# Altium schematic sheet BasicPeripherals.SchDoc
size A3
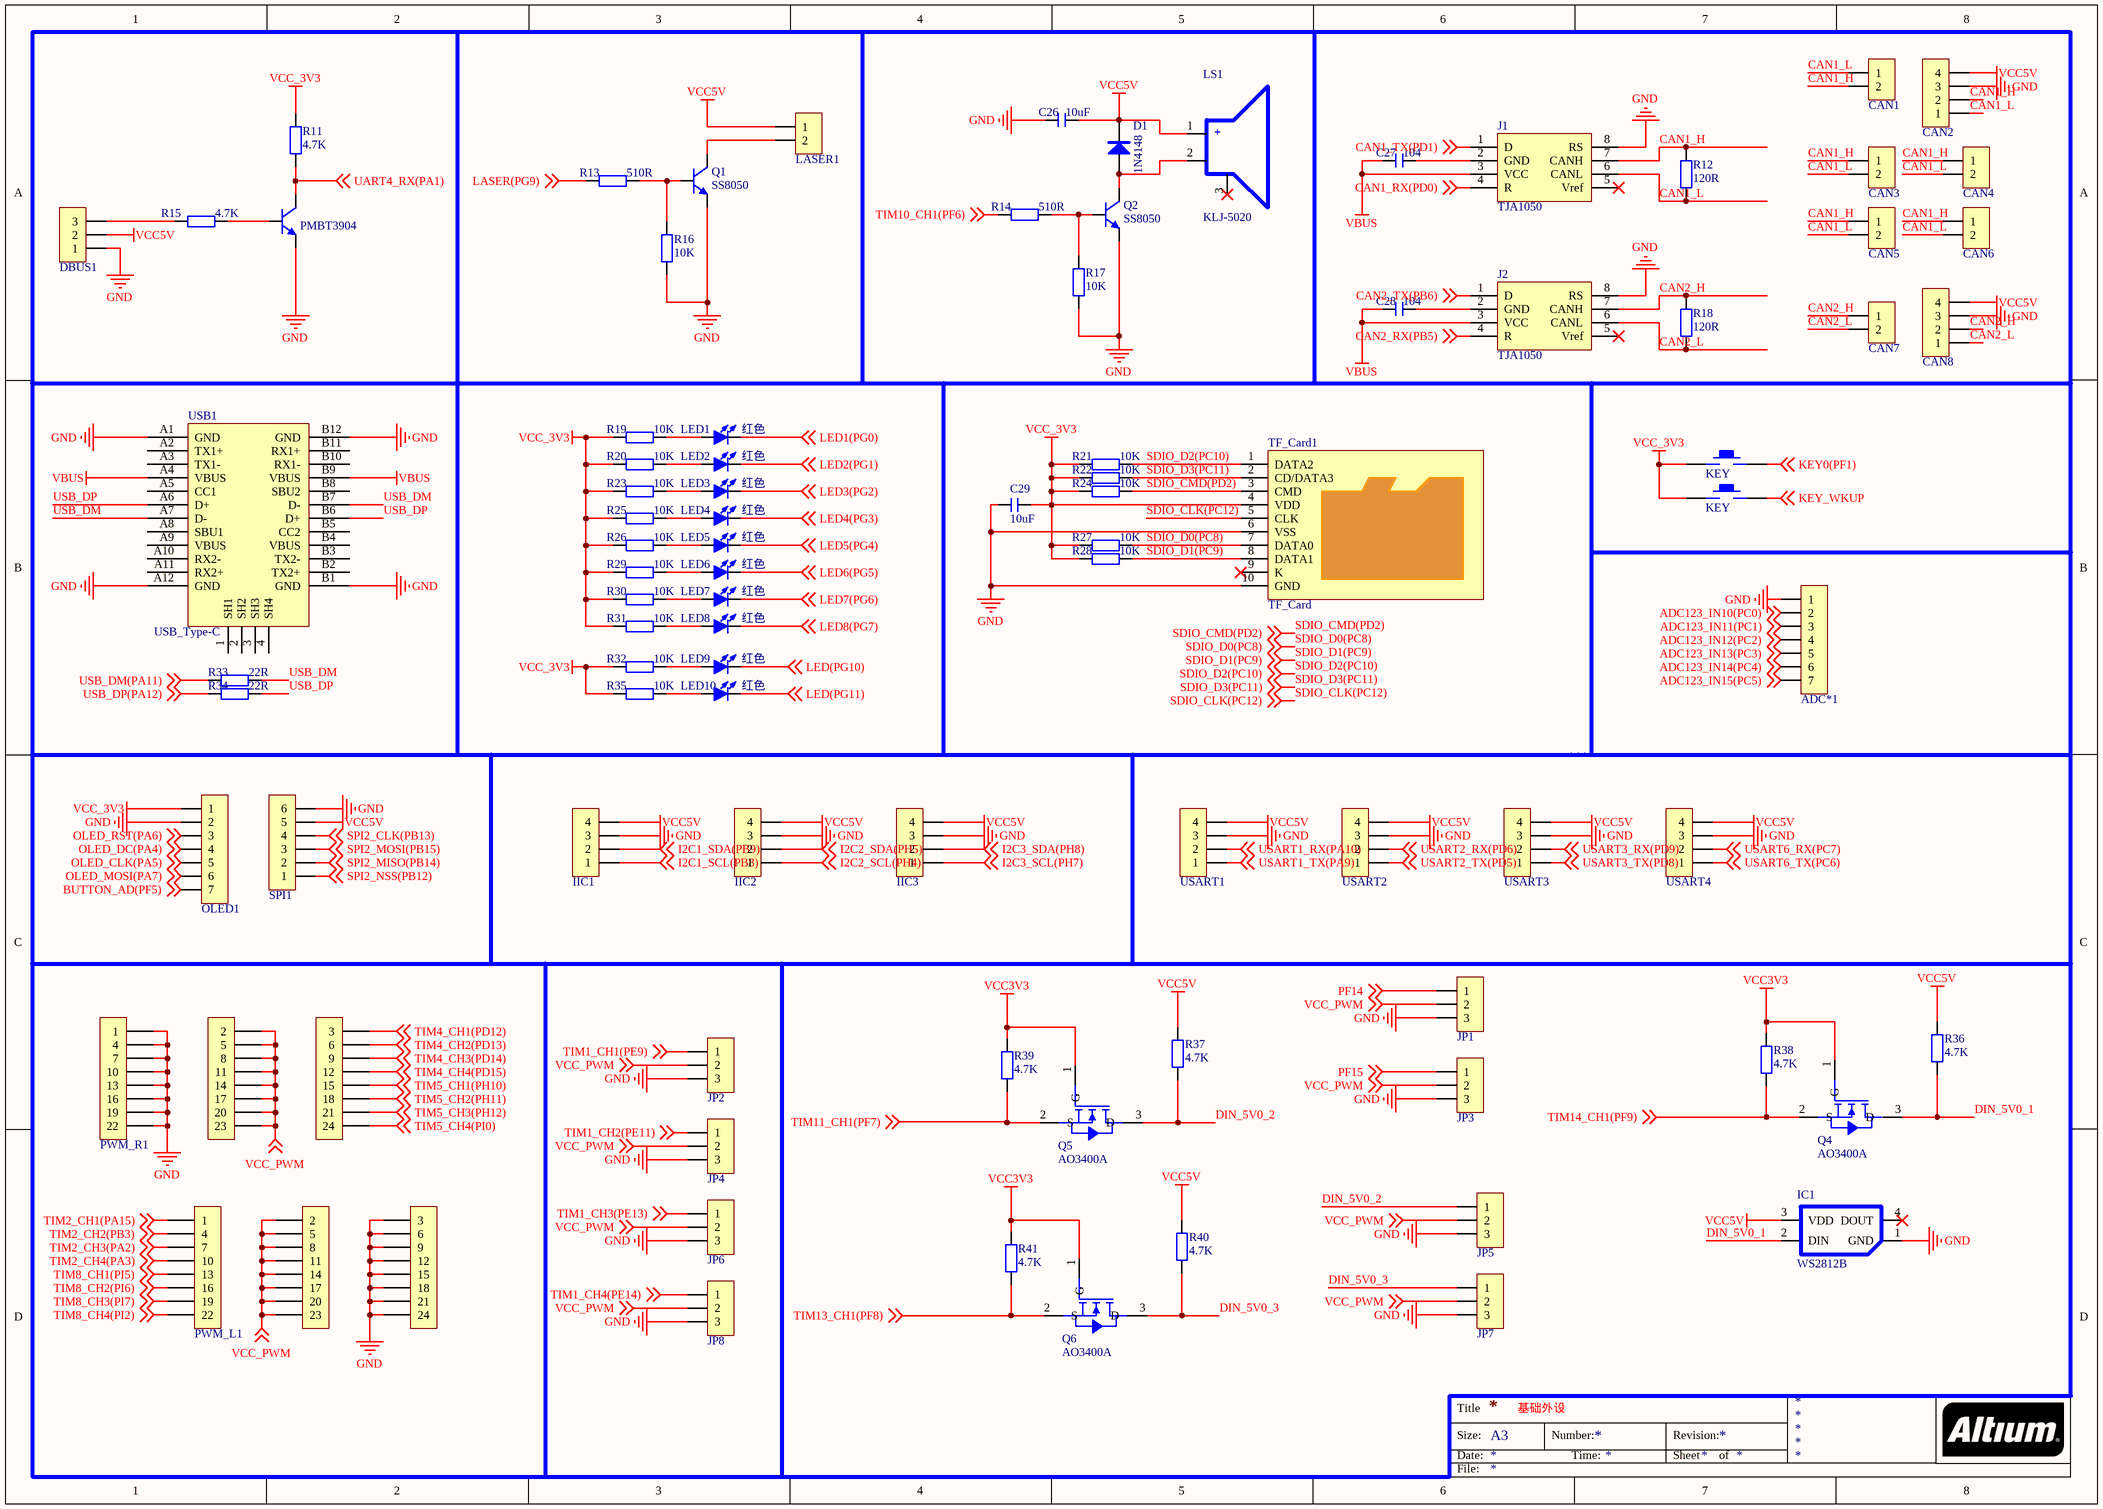
[diagram p0: BasicPeripherals.SchDoc]

## Parts
ADC*1  HDR-1X7  [MX 1.25-WS-7P]  (value not drawn)
C26  10uF  [C 0402_M]
C27  104  [C 0603_L]
C28  104  [C 0603_L]
C29  10uF  [C 0402_M]
CAN1  HDR-1X2  [MX 1.25-WS-2P]  (value not drawn)
CAN2  HDR-1X4  [MX 1.25-WS-4P]  (value not drawn)
CAN3  HDR-1X2  [MX 1.25-LS-2P]  (value not drawn)
CAN4  HDR-1X2  [MX 1.25-LS-2P]  (value not drawn)
CAN5  HDR-1X2  [MX 1.25-LS-2P]  (value not drawn)
CAN6  HDR-1X2  [MX 1.25-LS-2P]  (value not drawn)
CAN7  HDR-1X2  [MX 1.25-LS-2P]  (value not drawn)
CAN8  HDR-1X4  [MX 1.25-LS-4P]  (value not drawn)
D1  1N4148  [SOD-323]
DBUS1  HDR-1X3  [HDR2.54-WS-3P]  (value not drawn)
IC1  WS2812B  [LED 3528-4Pin]
IIC1  HDR-1X4  [MX 1.25-LS-4P]  (value not drawn)
IIC2  HDR-1X4  [MX 1.25-LS-4P]  (value not drawn)
IIC3  HDR-1X4  [MX 1.25-LS-4P]  (value not drawn)
J1  TJA1050  [SOIC-8_150mil]
J2  TJA1050  [SOIC-8_150mil]
JP1  HDR-1X3  [HDR2.54-LI-3P]  (value not drawn)
JP2  HDR-1X3  [HDR2.54-LI-3P]  (value not drawn)
JP3  HDR-1X3  [HDR2.54-LI-3P]  (value not drawn)
JP4  HDR-1X3  [HDR2.54-LI-3P]  (value not drawn)
JP5  HDR-1X3  [HDR2.54-LI-3P]  (value not drawn)
JP6  HDR-1X3  [HDR2.54-LI-3P]  (value not drawn)
JP7  HDR-1X3  [HDR2.54-LI-3P]  (value not drawn)
JP8  HDR-1X3  [HDR2.54-LI-3P]  (value not drawn)
LASER1  HDR-1X2  [MX 1.25-LS-2P]  (value not drawn)
LED1  红色  [LED 0805G]
LED2  红色  [LED 0805G]
LED3  红色  [LED 0805G]
LED4  红色  [LED 0805G]
LED5  红色  [LED 0805G]
LED6  红色  [LED 0805G]
LED7  红色  [LED 0805G]
LED8  红色  [LED 0805G]
LED9  红色  [LED 0805R]
LED10  红色  [LED 0805R]
LS1  KLJ-5020  [BUZ-SMD_4P-L5.0-W5.0-P3.80-TL]
OLED1  HDR-1X7  [MX 1.25-WS-7P]  (value not drawn)
PWM_L1  HDR3*8-left  [PIN-3*8-2.54 - duplicate]  (value not drawn)
PWM_R1  HDR3*8-right  [PIN-3*8-2.54 - duplicate]  (value not drawn)
Q1  SS8050  [SOT23-3L]
Q2  SS8050  [SOT23-3L]
Q3  PMBT3904  [SOT-23-3]
Q4  AO3400A  [SOT-23-3_L2.9-W1.3-P1.90-LS2.4-BR]
Q5  AO3400A  [SOT-23-3_L2.9-W1.3-P1.90-LS2.4-BR]
Q6  AO3400A  [SOT-23-3_L2.9-W1.3-P1.90-LS2.4-BR]
R11  4.7K  [R 0402_M]
R12  120R  [R 0402_M]
R13  510R  [R 0402_M]
R14  510R  [R 0402_M]
R15  4.7K  [R 0402_M]
R16  10K  [R 0402_M]
R17  10K  [R 0402_M]
R18  120R  [R 0402_M]
R19  10K  [R 0402_M]
R20  10K  [R 0402_M]
R21  10K  [R 0402_M]
R22  10K  [R 0402_M]
R23  10K  [R 0402_M]
R24  10K  [R 0402_M]
R25  10K  [R 0402_M]
R26  10K  [R 0402_M]
R27  10K  [R 0402_M]
R28  10K  [R 0402_M]
R29  10K  [R 0402_M]
R30  10K  [R 0402_M]
R31  10K  [R 0402_M]
R32  10K  [R 0402_M]
R33  22R  [R 0402_M]
R34  22R  [R 0402_M]
R35  10K  [R 0402_M]
R36  4.7K  [R 0402_M]
R37  4.7K  [R 0402_M]
R38  4.7K  [R 0402_M]
R39  4.7K  [R 0402_M]
R40  4.7K  [R 0402_M]
R41  4.7K  [R 0402_M]
RST2  KEY  [SMD-3.2*4.2]
RST3  KEY  [SMD-3.2*4.2]
SPI1  HDR-1X6  [MX 1.25-LS-6P]  (value not drawn)
TF_Card1  TF_Card  [Micro SD]
USART1  HDR-1X4  [MX 1.25-LS-4P]  (value not drawn)
USART2  HDR-1X4  [MX 1.25-LS-4P]  (value not drawn)
USART3  HDR-1X4  [MX 1.25-LS-4P]  (value not drawn)
USART4  HDR-1X4  [MX 1.25-LS-4P]  (value not drawn)
USB1  USB_Type-C  [Type-C-TOP]

## Nets
GND: ADC*1.1 C26.2 C29.1 CAN2.3 CAN8.3 DBUS1.1 IC1.1(GND) IIC1.3 IIC2.3 IIC3.3 J1.8(RS) J2.8(RS) JP1.3 JP2.3 JP3.3 JP4.3 JP5.3 JP6.3 JP7.3 JP8.3 OLED1.2 PWM_L1.3 PWM_L1.6 PWM_L1.9 PWM_L1.12 PWM_L1.15 PWM_L1.18 PWM_L1.21 PWM_L1.24 PWM_R1.1 PWM_R1.4 PWM_R1.7 PWM_R1.10 PWM_R1.13 PWM_R1.16 PWM_R1.19 PWM_R1.22 Q1.2(E) Q2.2(E) Q3.2(E) R16.1 R17.1 SPI1.6 TF_Card1.6(VSS) TF_Card1.10(GND) USART1.3 USART2.3 USART3.3 USART4.3 USB1.A1(GND) USB1.A12(GND) USB1.B1(GND) USB1.B12(GND)
VBUS: C27.2 C28.2 J1.3(VCC) J2.3(VCC) USB1.A4(VBUS) USB1.B9(VBUS)
VCC3V3: Q4.1(G) Q5.1(G) Q6.1(G) R38.1 R39.1 R41.1
VCC5V: C26.1 CAN2.4 CAN8.4 D1.2(K) DBUS1.2 IC1.3(VDD) IIC1.4 IIC2.4 IIC3.4 LASER1.1 LS1.1 R36.1 R37.1 R40.1 SPI1.5 USART1.4 USART2.4 USART3.4 USART4.4
VCC_3V3: C29.2 OLED1.1 R11.2 R19.1 R20.1 R21.1 R22.1 R23.1 R24.1 R25.1 R26.1 R27.1 R28.1 R29.1 R30.1 R31.1 R32.1 R35.1 RST2.1 RST3.1 TF_Card1.4(VDD)
ADC123_IN10(PC0): ADC*1.2 ; off-sheet ADC123_IN10(PC0)
ADC123_IN11(PC1): ADC*1.3 ; off-sheet ADC123_IN11(PC1)
ADC123_IN12(PC2): ADC*1.4 ; off-sheet ADC123_IN12(PC2)
ADC123_IN13(PC3): ADC*1.5 ; off-sheet ADC123_IN13(PC3)
ADC123_IN14(PC4): ADC*1.6 ; off-sheet ADC123_IN14(PC4)
ADC123_IN15(PC5): ADC*1.7 ; off-sheet ADC123_IN15(PC5)
BUTTON_AD(PF5): OLED1.7 ; off-sheet BUTTON_AD(PF5)
CAN1_H: CAN1.2 CAN2.2 CAN3.1 CAN4.1 CAN5.1 CAN6.1 J1.7(CANH) R12.2
CAN1_L: CAN1.1 CAN2.1 CAN3.2 CAN4.2 CAN5.2 CAN6.2 J1.6(CANL) R12.1
CAN1_RX(PD0): J1.4(R) ; off-sheet CAN1_RX(PD0)
CAN1_TX(PD1): J1.1(D) ; off-sheet CAN1_TX(PD1)
CAN2_H: CAN7.1 CAN8.2 J2.7(CANH) R18.2
CAN2_L: CAN7.2 CAN8.1 J2.6(CANL) R18.1
CAN2_RX(PB5): J2.4(R) ; off-sheet CAN2_RX(PB5)
CAN2_TX(PB6): J2.1(D) ; off-sheet CAN2_TX(PB6)
DIN_5V0_1: IC1.2(DIN) Q4.3(D) R36.2
DIN_5V0_2: JP5.1 Q5.3(D) R37.2
DIN_5V0_3: JP7.1 Q6.3(D) R40.2
I2C1_SCL(PB8): IIC1.1 ; off-sheet I2C1_SCL(PB8)
I2C1_SDA(PB9): IIC1.2 ; off-sheet I2C1_SDA(PB9)
I2C2_SCL(PH4): IIC2.1 ; off-sheet I2C2_SCL(PH4)
I2C2_SDA(PH5): IIC2.2 ; off-sheet I2C2_SDA(PH5)
I2C3_SCL(PH7): IIC3.1 ; off-sheet I2C3_SCL(PH7)
I2C3_SDA(PH8): IIC3.2 ; off-sheet I2C3_SDA(PH8)
KEY0(PF1): RST2.2 ; off-sheet KEY0(PF1)
KEY_WKUP: RST3.2 ; off-sheet KEY_WKUP
LASER(PG9): R13.1 ; off-sheet LASER(PG9)
LED1(PG0): LED1.2(K) ; off-sheet LED1(PG0)
LED2(PG1): LED2.2(K) ; off-sheet LED2(PG1)
LED3(PG2): LED3.2(K) ; off-sheet LED3(PG2)
LED4(PG3): LED4.2(K) ; off-sheet LED4(PG3)
LED5(PG4): LED5.2(K) ; off-sheet LED5(PG4)
LED6(PG5): LED6.2(K) ; off-sheet LED6(PG5)
LED7(PG6): LED7.2(K) ; off-sheet LED7(PG6)
LED8(PG7): LED8.2(K) ; off-sheet LED8(PG7)
LED(PG10): LED9.2(K) ; off-sheet LED(PG10)
LED(PG11): LED10.2(K) ; off-sheet LED(PG11)
OLED_CLK(PA5): OLED1.5 ; off-sheet OLED_CLK(PA5)
OLED_DC(PA4): OLED1.4 ; off-sheet OLED_DC(PA4)
OLED_MOSI(PA7): OLED1.6 ; off-sheet OLED_MOSI(PA7)
OLED_RST(PA6): OLED1.3 ; off-sheet OLED_RST(PA6)
PF14: JP1.1 ; off-sheet PF14
PF15: JP3.1 ; off-sheet PF15
SDIO_CLK(PC12): TF_Card1.5(CLK) ; off-sheet SDIO_CLK(PC12)
SDIO_CMD(PD2): R24.2 TF_Card1.3(CMD) ; off-sheet SDIO_CMD(PD2)
SDIO_D0(PC8): R27.2 TF_Card1.7(DATA0) ; off-sheet SDIO_D0(PC8)
SDIO_D1(PC9): R28.2 TF_Card1.8(DATA1) ; off-sheet SDIO_D1(PC9)
SDIO_D2(PC10): R21.2 TF_Card1.1(DATA2) ; off-sheet SDIO_D2(PC10)
SDIO_D3(PC11): R22.2 TF_Card1.2(CD/DATA3) ; off-sheet SDIO_D3(PC11)
SPI2_CLK(PB13): SPI1.4 ; off-sheet SPI2_CLK(PB13)
SPI2_MISO(PB14): SPI1.2 ; off-sheet SPI2_MISO(PB14)
SPI2_MOSI(PB15): SPI1.3 ; off-sheet SPI2_MOSI(PB15)
SPI2_NSS(PB12): SPI1.1 ; off-sheet SPI2_NSS(PB12)
TIM1_CH1(PE9): JP2.1 ; off-sheet TIM1_CH1(PE9)
TIM1_CH2(PE11): JP4.1 ; off-sheet TIM1_CH2(PE11)
TIM1_CH3(PE13): JP6.1 ; off-sheet TIM1_CH3(PE13)
TIM1_CH4(PE14): JP8.1 ; off-sheet TIM1_CH4(PE14)
TIM2_CH1(PA15): PWM_L1.1 ; off-sheet TIM2_CH1(PA15)
TIM2_CH2(PB3): PWM_L1.4 ; off-sheet TIM2_CH2(PB3)
TIM2_CH3(PA2): PWM_L1.7 ; off-sheet TIM2_CH3(PA2)
TIM2_CH4(PA3): PWM_L1.10 ; off-sheet TIM2_CH4(PA3)
TIM4_CH1(PD12): PWM_R1.3 ; off-sheet TIM4_CH1(PD12)
TIM4_CH2(PD13): PWM_R1.6 ; off-sheet TIM4_CH2(PD13)
TIM4_CH3(PD14): PWM_R1.9 ; off-sheet TIM4_CH3(PD14)
TIM4_CH4(PD15): PWM_R1.12 ; off-sheet TIM4_CH4(PD15)
TIM5_CH1(PH10): PWM_R1.15 ; off-sheet TIM5_CH1(PH10)
TIM5_CH2(PH11): PWM_R1.18 ; off-sheet TIM5_CH2(PH11)
TIM5_CH3(PH12): PWM_R1.21 ; off-sheet TIM5_CH3(PH12)
TIM5_CH4(PI0): PWM_R1.24 ; off-sheet TIM5_CH4(PI0)
TIM8_CH1(PI5): PWM_L1.13 ; off-sheet TIM8_CH1(PI5)
TIM8_CH2(PI6): PWM_L1.16 ; off-sheet TIM8_CH2(PI6)
TIM8_CH3(PI7): PWM_L1.19 ; off-sheet TIM8_CH3(PI7)
TIM8_CH4(PI2): PWM_L1.22 ; off-sheet TIM8_CH4(PI2)
TIM10_CH1(PF6): R14.1 ; off-sheet TIM10_CH1(PF6)
TIM11_CH1(PF7): Q5.2(S) R39.2 ; off-sheet TIM11_CH1(PF7)
TIM13_CH1(PF8): Q6.2(S) R41.2 ; off-sheet TIM13_CH1(PF8)
TIM14_CH1(PF9): Q4.2(S) R38.2 ; off-sheet TIM14_CH1(PF9)
UART4_RX(PA1): Q3.3(C) R11.1 ; off-sheet UART4_RX(PA1)
USART1_RX(PA10): USART1.2 ; off-sheet USART1_RX(PA10)
USART1_TX(PA9): USART1.1 ; off-sheet USART1_TX(PA9)
USART2_RX(PD6): USART2.2 ; off-sheet USART2_RX(PD6)
USART2_TX(PD5): USART2.1 ; off-sheet USART2_TX(PD5)
USART3_RX(PD9): USART3.2 ; off-sheet USART3_RX(PD9)
USART3_TX(PD8): USART3.1 ; off-sheet USART3_TX(PD8)
USART6_RX(PC7): USART4.2 ; off-sheet USART6_RX(PC7)
USART6_TX(PC6): USART4.1 ; off-sheet USART6_TX(PC6)
USB_DM: R33.2 USB1.A7(D-) USB1.B7(D-)
USB_DM(PA11): R33.1 ; off-sheet USB_DM(PA11)
USB_DP: R34.2 USB1.A6(D+) USB1.B6(D+)
USB_DP(PA12): R34.1 ; off-sheet USB_DP(PA12)
VCC_PWM: JP1.2 JP2.2 JP3.2 JP4.2 JP5.2 JP6.2 JP7.2 JP8.2 PWM_L1.2 PWM_L1.5 PWM_L1.8 PWM_L1.11 PWM_L1.14 PWM_L1.17 PWM_L1.20 PWM_L1.23 PWM_R1.2 PWM_R1.5 PWM_R1.8 PWM_R1.11 PWM_R1.14 PWM_R1.17 PWM_R1.20 PWM_R1.23 ; off-sheet VCC_PWM
NetC27_1: C27.1 J1.2(GND)
NetC28_1: C28.1 J2.2(GND)
NetD1_1: D1.1(A) LS1.2 Q2.3(C)
NetDBUS1_3: DBUS1.3 R15.2
NetLASER1_2: LASER1.2 Q1.3(C)
NetLED1_1: LED1.1(A) R19.2
NetLED2_1: LED2.1(A) R20.2
NetLED3_1: LED3.1(A) R23.2
NetLED4_1: LED4.1(A) R25.2
NetLED5_1: LED5.1(A) R26.2
NetLED6_1: LED6.1(A) R29.2
NetLED7_1: LED7.1(A) R30.2
NetLED8_1: LED8.1(A) R31.2
NetLED9_1: LED9.1(A) R32.2
NetLED10_1: LED10.1(A) R35.2
NetQ1_1: Q1.1(B) R13.2 R16.2
NetQ2_1: Q2.1(B) R14.2 R17.2
NetQ3_1: Q3.1(B) R15.1

Not connected (* = marked no-connect by the designer): IC1 4(DOUT)*; J1 5(Vref)*; J2 5(Vref)*; LS1 3*; TF_Card1 9(K)*; USB1 1(SH1) 2(SH2) 3(SH3) 4(SH4) A2(TX1+) A3(TX1-) A5(CC1) A8(SBU1) A9(VBUS) A10(RX2-) A11(RX2+) B2(TX2+) B3(TX2-) B4(VBUS) B5(CC2) B8(SBU2) B10(RX1-) B11(RX1+)

## Notes on the sheet
- 基础外设
- Title
- Size:
- Date:
- A3
- Number:
- Time:
- Revision:
- Sheet
- of
- File:
- (in symbol KLJ-5020) +

## Library data of the parts
ADC*1 OLED1 = Header 7: 7P接插件
C26-C29 = C: 贴片电容
CAN1 CAN3-CAN7 LASER1 = Header 2: 2P接插件
CAN2 CAN8 IIC1-IIC3 USART1-USART4 = Header 4: 4P接插件
D1 = 1N4148: 开关二极管
DBUS1 JP1-JP8 = Header 3: 3P接插件
J1 J2 = TJA1050: CAN芯片
LED1-LED10 = LED-SMD: 贴片LED
LS1 = KLJ-5020: 蜂鸣器
PWM_L1 = HDR3*8-left: Connector
PWM_R1 = HDR3*8-right: Connector
Q1 Q2 = 8050-SMD: 高频放大-NPN型
Q3 = PMBT3904: NPN Bipolar Transistor
R11-R41 = R: 贴片电阻
RST2 RST3 = KEY_M
SPI1 = Header 6: 6P接插件
TF_Card1 = TF_Card: TF卡座